# EAGLE design laser_driver (EAGLE 7.4.0)
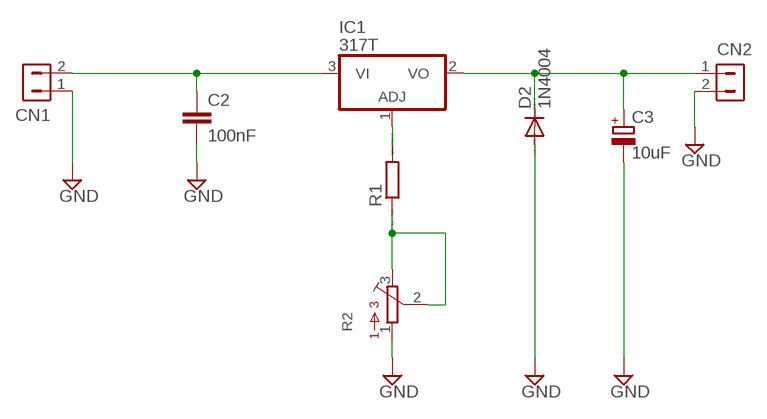
[diagram p0: schematic, sheet 1]

## Parts
C2  100nF  C2,5-3  [C2.5-3]
C3  10uF  CPOL-EUE2-5  [E2-5]
CN1  HDR-1X2-SIP-100  [SIP-100-2V]
CN2  HDR-1X2-SIP-100  [SIP-100-2V]
D2  1N4004  [DO41-10]
IC1  317T  [TO220H]
R1  R0204/7  [0204/7]
R2  3386-F  [3386F]

## Nets
GND: C2.2 C3.- CN1.1 CN2.2 D2.A R2.1
N$1: C2.1 CN1.2 IC1.3(VI)
N$4: IC1.1(ADJ) R1.2
N$5: R1.1 R2.2 R2.3
N$6: C3.+ CN2.1 D2.C IC1.2(VO)

## Library data of the parts
C2 = capacitor-wima:C: CAPACITOR naming: grid - package width
C3 = rcl:CPOL-EU: POLARIZED CAPACITOR, European symbol
CN1 CN2 = con-hdrs40:HDR-1X2: HEADER CONNECTOR
D2 = diode:1N4004: DIODE general purpose rectifier, 1 A
IC1 = linear:*317: Positive VOLTAGE REGULATOR
R1 = eagle-ltspice:R: RESISTOR, European symbol; SPICEMODEL: NONE; SPICEPREFIX: R
R2 = bourns:3386-: 3386 Series 3/8" Square Trimmer

## Board
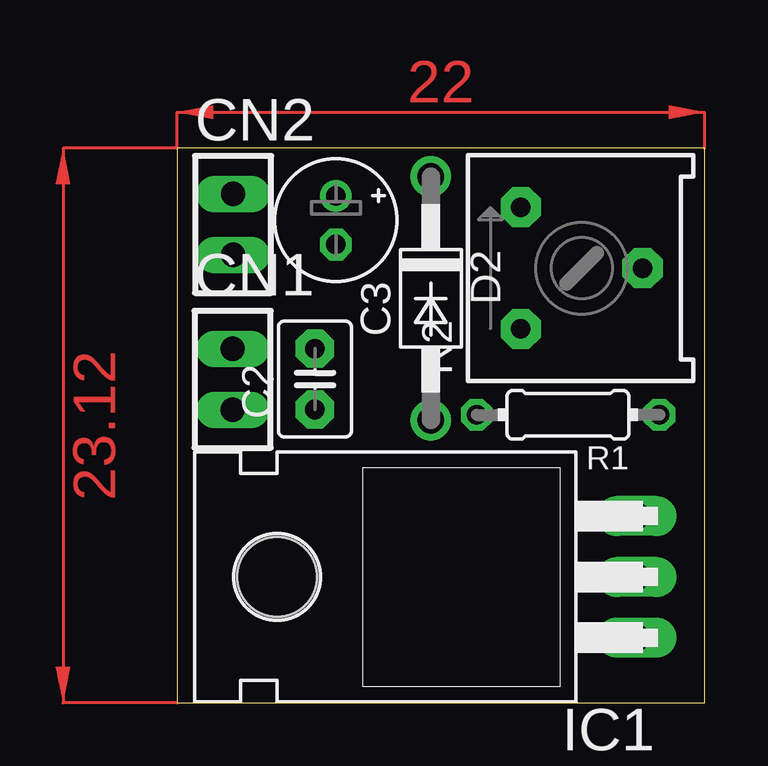
[diagram p1: board, top side]
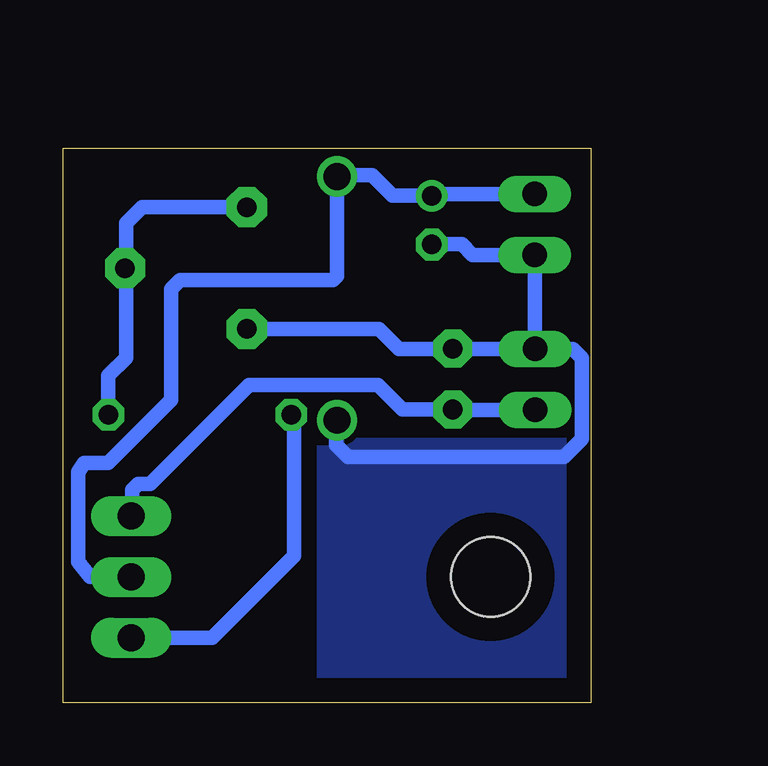
[diagram p2: board, bottom side, seen from below]

Size 22 x 23.12 mm. Coordinates in mm from the lower left corner, seen from the top.
Outline: 0,0 22,0 22,23.12 0,23.12 0,0
Copper layers (1*16): Top 0.035mm / dielectric 1.5mm / Bottom 0.035mm
Design rules "default": minimum track width 10mil, minimum drill 24mil, track to track 8mil, track to pad 8mil, pad to pad 8mil, via to via 8mil, smd to smd 8mil, copper to edge 40mil, drill to drill 8mil, minimum pad ring 10mil, minimum via ring 8mil, stop-mask expansion 4mil, vias tented up to drill 0mil, thermal gap 10mil

### Footprints (pad centres in the part's own frame; a part is rotated, then mirrored left to right if it is on the bottom)
C2.5-3 = drill 0.813 pad 1.6 octagon: 1 -1.27,0; 2 1.27,0
E2-5 = drill 0.813 pad 1.27: + -1.016,0 | drill 0.813 pad 1.27 octagon: - 1.016,0
SIP-100-2V = drill 1.016 long: 1 -1.27,0; 2 1.27,0
DO41-10 = drill 1.118: A 5.08,0; C -5.08,0
TO220H = drill 1.118 long: 1 -2.54,-10.16; 2 0,-10.16; 3 2.54,-10.16 | hole 3.302: 0,4.826
0204/7 = drill 0.813 octagon: 1 -3.81,0; 2 3.81,0
3386F = drill 0.813 pad 1.676 octagon: 1 -2.54,2.54; 2 0,-2.54; 3 2.54,2.54

### Placement (x,y rotation side)
C2  5.75,13.5 90 top
C3  [E2-5]  6.62,20.12 270 top
CN1  2.32,13.48 270 top
CN2  2.34,19.95 270 top
D2  10.58,16.87 270 top
IC1  9,5.25 90 top
R1  16.3,12.01 180 top
R2  16.88,18.12 90 top

### Tracks (layer width: path | path; a pad name or v marks a point on that pad's centre or on a via)
GND
  Bottom 0.61: CN1.1 2.32,18.66 CN2.2 4.93,18.67 5.38,19.12 6.61,19.12 C3.- | CN1.1 5.73,14.76 C2.2 5.77,14.75 8,14.75 8.84,15.59 R2.1 | 10.62,11.83 D2.A 10.62,11.74 10.62,10.75 10.12,10.25 1.12,10.25 0.38,11 0.38,14.38 0.75,14.75 CN1.1
  pour Bottom (isolate 0.1): 0,10.75 11.12,10.75 11.12,0.25 0.12,0.25 0.12,8.88
N$1
  Bottom 0.61: CN1.2 5.73,12.22 C2.1 7.86,12.23 8.88,13.25 14.25,13.25 18.38,9.12 18.88,9.12 19.12,8.88 19.12,7.83 IC1.3
N$4
  Bottom 0.61: IC1.1 15.79,2.71 12.38,6.12 12.38,11.9 R1.2
N$5
  Bottom 0.61: R2.3 18.71,20.66 19.38,20 19.38,18.16 R2.2 19.38,18.09 19.38,14.38 20.11,13.64 R1.1
N$6
  Bottom 0.61: CN2.1 6.55,21.22 C3.+ 8.27,21.14 9.12,22 10.52,22 D2.C 10.58,17.8 10.75,17.62 17.12,17.62 17.5,17.25 17.5,12.62 20.12,10 21.12,10 21.38,9.62 21.38,5.88 20.88,5.25 IC1.2
(copper drawn outside any net)
  shapes: Top area x2